# Altium project Balanced Photodiode.PrjPcb
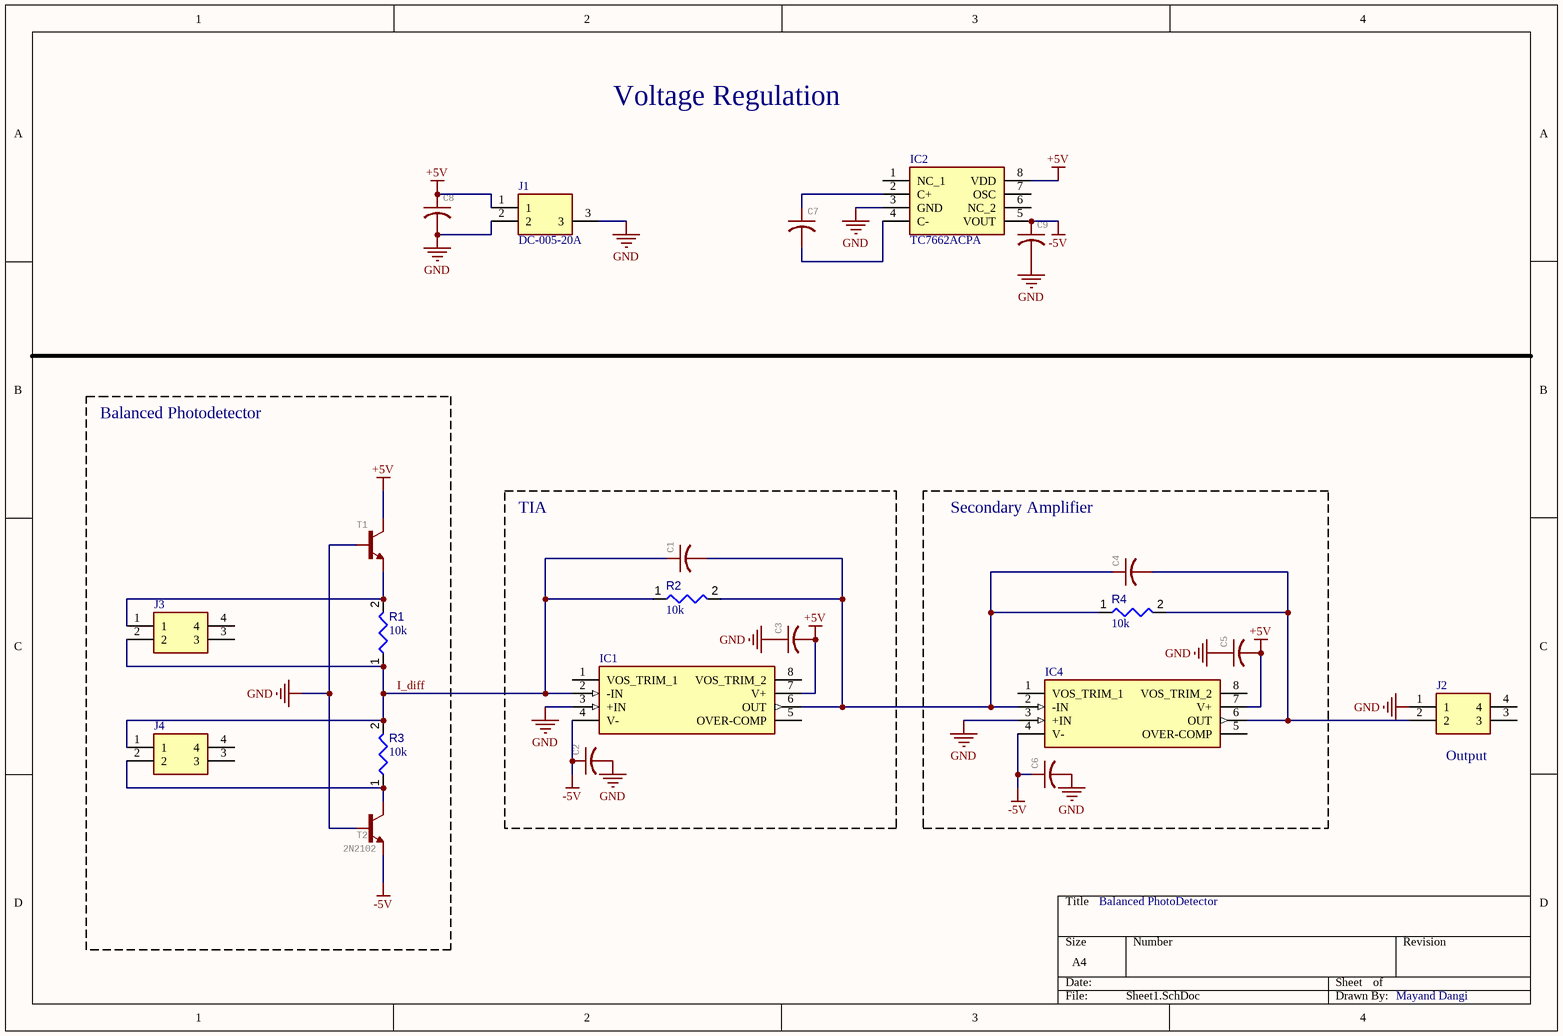
[diagram p0: Sheet1.SchDoc]
1 sheet, 22 parts. Net scope: global (net labels, ports and power ports of the same name join across sheets).
Board file: PCB1.PcbDoc

## Sheet Sheet1.SchDoc
size A4; SheetNumber: 1; SheetTotal: 1

### Parts
C1  C-US025-030X050  [C025-030X050]  (value not drawn)
C2  C-US025-030X050  [C025-030X050]  (value not drawn)
C3  C-US025-030X050  [C025-030X050]  (value not drawn)
C4  C-US025-030X050  [C025-030X050]  (value not drawn)
C5  C-US025-030X050  [C025-030X050]  (value not drawn)
C6  C-US025-030X050  [C025-030X050]  (value not drawn)
C7  C-US025-030X050  [C025-030X050]  (value not drawn)
C8  C-US025-030X050  [C025-030X050]  (value not drawn)
C9  C-US025-030X050  [C025-030X050]  (value not drawn)
IC1  LT1028ACN8#PBF  [DIP794W53P254L1016H394Q8N]  (value not drawn)
IC2  TC7662ACPA  [DIP762W56P254L950H508Q8N]
IC4  LT1028ACN8#PBF  [DIP794W53P254L1016H394Q8N]  (value not drawn)
J1  DC-005-20A  [DC00520A]
J2  1-1337543-0  [1-1337543-0]  (value not drawn)
J3  1-1337543-0  [1-1337543-0]  (value not drawn)
J4  1-1337543-0  [1-1337543-0]  (value not drawn)
R1  value 10k  [RESA60-630X240]  (hidden comment: MFR-25FBF52-10K)
R2  value 10k  [RESA60-630X240]  (hidden comment: MFR-25FBF52-10K)
R3  value 10k  [RESA60-630X240]  (hidden comment: MFR-25FBF52-10K)
R4  value 10k  [RESA60-630X240]  (hidden comment: MFR-25FBF52-10K)
T1  2N2102  [TO5]  (value not drawn)
T2  2N2102  [TO5]

### Blocks framed on the sheet
Balanced Photodetector: J3 J4 R1 R3 T1 T2
TIA: C1-C3 IC1 R2
Secondary Amplifier: C4-C6 IC4 R4

### Nets
+5V: C3.2 C5.2 C8.1 IC1.7(V+) IC2.8(VDD) IC4.7(V+) J1.1 T1.3(C)
-5V: C2.1 C6.1 C9.1 IC1.4(V-) IC2.5(VOUT) IC4.4(V-) T2.1(E)
GND: C2.2 C3.1 C5.1 C6.2 C8.2 C9.2 IC1.3(+IN) IC2.3(GND) IC4.3(+IN) J1.2 J1.3 J2.1 T1.2(B) T2.2(B)
I_diff: C1.1 IC1.2(-IN) J3.2 J4.1 R1.1 R2.1 R3.2
NetC1_2: C1.2 C4.1 IC1.6(OUT) IC4.2(-IN) R2.2 R4.1
NetC4_2: C4.2 IC4.6(OUT) J2.2 R4.2
NetC7_1: C7.1 IC2.2(C+)
NetC7_2: C7.2 IC2.4(C-)
NetJ3_1: J3.1 R1.2 T1.1(E)
NetJ4_2: J4.2 R3.1 T2.3(C)

Not connected (* = marked no-connect by the designer): IC1 1(VOS_TRIM_1) 5(OVER-COMP) 8(VOS_TRIM_2); IC2 1(NC_1) 6(NC_2) 7(OSC); IC4 1(VOS_TRIM_1) 5(OVER-COMP) 8(VOS_TRIM_2); J2 3 4; J3 3 4; J4 3 4

### Notes on the sheet
- Voltage Regulation
- (near J2) Output
- Balanced PhotoDetector
- Mayand Dangi

### Library data of the parts
C1-C9 = C-US025-030X050: CAPACITOR, American symbol; GateName_1: G$1; SymbolName_1: C-US; DeviceName: 025-030X050; LibraryName: adafruit; DeviceSetName: C-US
IC1 IC4 = LT1028ACN8#PBF: Integrated Circuit; Manufacturer_Name: Linear Technology; Datasheet Link: http://cds.linear.com/docs/en/datasheet/1028fd.pdf; Height: 3.937mm; Manufacturer_Part_Number: LT1028ACN8#PBF
IC2 = TC7662ACPA: Integrated Circuit; Manufacturer_Name: Microchip; Datasheet Link: http://componentsearchengine.com/Datasheets/3/TC7662ACPA.pdf; Height: 5.08mm; Manufacturer_Part_Number: TC7662ACPA; Mouser Part Number: 579-TC7662ACPA; Mouser Price/Stock: https://www.mouser.co.uk/ProductDetail/Microchip-Technology/TC7662ACPA?qs=3huTxzs8ogqC%2FBEmAt4AWg%3D%3D; Arrow Part Number: TC7662ACPA; Arrow Price/Stock: https://www.arrow.com/en/products/tc7662acpa/microchip-technology?region=nac
J1 = DC-005-20A: Connector; Manufacturer_Name: Korean Hroparts Elec; Datasheet Link: https://datasheet.lcsc.com/szlcsc/Korean-Hroparts-Elec-DC-005-20A_C130239.pdf; Height: 11mm; Manufacturer_Part_Number: DC-005-20A
J2-J4 = 1-1337543-0: Connector; Manufacturer_Name: TE Connectivity; Datasheet Link: http://www.te.com/commerce/DocumentDelivery/DDEController?Action=srchrtrv&DocNm=1337543&DocType=Customer+Drawing&DocLang=English; Manufacturer_Part_Number: 1-1337543-0; Mouser Part Number: 571-1-1337543-0; Mouser Price/Stock: https://www.mouser.co.uk/ProductDetail/TE-Connectivity-AMP/1-1337543-0?qs=C39VGJgkyqP7s5Z2V1r6VA%3D%3D; Arrow Part Number: 1-1337543-0; Arrow Price/Stock: https://www.arrow.com/en/products/1-1337543-0/te-connectivity?region=nac
R1-R4 = CMP-009-00047-4: Axial Resistor, 10 KOhm, +/- 1%, 0.25 W, -55 to 155 degC, 2-Pin THD, RoHS, Bulk; Manufacturer: Yageo; Power: 250mW; Voltage Rating: 250V; Manufacturer URL: http://www.yageo.com/; Datasheet URL: http://www.yageo.com/documents/recent/Yageo%20LR_MFR_2013.pdf; Package Reference: MFR-25; Min Operating Temperature: -55°C; Mounting Technology: TH; Package Quantity: 200; Case/Package: Axial; Tolerance: 1%; RoHS Compliant: True; Datasheet Version: Apr-13; Packaging: Bulk; Max Operating Temperature: 155°C; Package Description: 2-Pin Axial Lead, Dia 2.4 mm, Body Length 6.3 mm
T1 T2 = 2N2102: NPN TRANSISTOR; GateName_1: G$1; POPULARITY: 0; SymbolName_1: NPN; LibraryName: transistor; DeviceSetName: 2N2102